# Altium schematic sheet ESP32_PICO_D4_QFN-48-EP(7x7).schdoc
size 127 x 101 mm
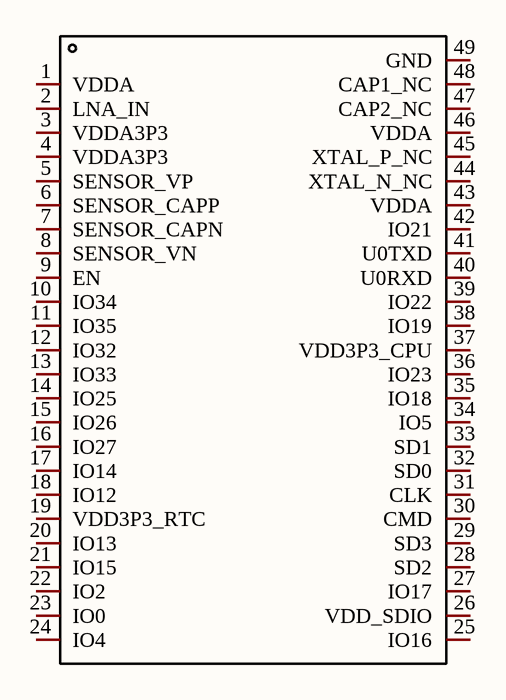
[diagram p0: ESP32_PICO_D4_QFN-48-EP(7x7).schdoc]

## Parts
U?  ESP32-PICO-D4  [LGA-48_L7.0-W7.0-P0.50-BL-EP5.4]  (value not drawn)

## Nets

Not connected (* = marked no-connect by the designer): U? 1(VDDA) 2(LNA_IN) 3(VDDA3P3) 4(VDDA3P3) 5(SENSOR_VP) 6(SENSOR_CAPP) 7(SENSOR_CAPN) 8(SENSOR_VN) 9(EN) 10(IO34) 11(IO35) 12(IO32) 13(IO33) 14(IO25) 15(IO26) 16(IO27) 17(IO14) 18(IO12) 19(VDD3P3_RTC) 20(IO13) 21(IO15) 22(IO2) 23(IO0) 24(IO4) 25(IO16) 26(VDD_SDIO) 27(IO17) 28(SD2) 29(SD3) 30(CMD) 31(CLK) 32(SD0) 33(SD1) 34(IO5) 35(IO18) 36(IO23) 37(VDD3P3_CPU) 38(IO19) 39(IO22) 40(U0RXD) 41(U0TXD) 42(IO21) 43(VDDA) 44(XTAL_N_NC) 45(XTAL_P_NC) 46(VDDA) 47(CAP2_NC) 48(CAP1_NC) 49(GND)

## Library data of the parts
U? = ESP32-PICO-D4: Manufacturer: ESPRESSIF(乐鑫); Add into BOM: yes; Frequency Range: 2.4GHz~2.5GHz; Interface: ADC, SDIO, SPI, PWM, UART, I2C, I2S, GPIO; Operating Voltage: 2.7V~3.6V; Symbol: ESP32-PICO-D4; Device: ESP32-PICO-D4; Supplier: LCSC; Supplier Part: C193707; Manufacturer Part: ESP32-PICO-D4; JLCPCB Part Class: Extended Part; Value: -; LCSC Part Name: 集成2.4GHz WIFI和蓝牙的模组; Supplier Footprint: QFN-48-EP(7x7); Datasheet: https://atta.szlcsc.com/upload/public/pdf/source/20180531/C193707_20E6BADDB6EC95F0C0D505BA515D2866.pdf; Convert to PCB: yes; Applications: 蓝牙,WiFi; Output Power: -; Data Rate: -; Current Of Transmitting: -; Sensitivity: -; Receive Current: -; Typical Application Frequency: -; Operating Temperature: -40℃~+85℃